# EAGLE schematic Simple-Transmitter-2SC9014 (EAGLE 7.6.0)
Simple FM Transmitter with Electret Microphone, based on NPN Transistor
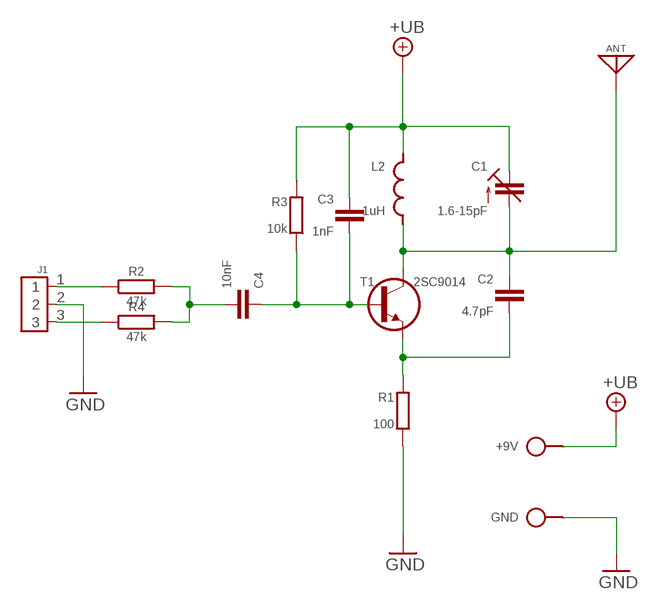
[diagram p0: schematic, sheet 1]

## Parts
+9V  SPAD  [SPAD]
ANT  ANT  [SPAD]
C1  1.6-15pF  C-TR-PH201272222-808-2PINB  [TRIM-2222-808]
C2  4.7pF  C025-015X024  [C025-015X024]
C3  1nF  C025-015X024  [C025-015X024]
C4  10nF  C050-020X036/V  [C050-020X036/V]
GND  SPAD  [SPAD]
J1  CONN-3P-3P  [CONN-3P]
L2  1uH  L-SHORT04/7  [L-04/7]
R1  100  R0204/2V  [0204/2V]
R2  47k  R-H0204/10-V  [0204/10-V]
R3  10k  R0204/10-V  [0204/10-V]
R4  47k  R-H0204/10-V  [0204/10-V]
T1  2SC9014  [TO92-EBC]

## Nets
+UB: +9V.1 C1.3(E) C3.1 L2.2 R3.1
GND: GND.1 J1.2 R1.1
N$1: J1.3 R4.1
N$2: ANT.1 C1.2(A) C2.1 L2.1 T1.C
N$3: C2.2 R1.2 T1.E
N$4: J1.1 R2.1
N$5: C3.2 C4.1 R3.2 T1.B
N$6: C4.2 R2.2 R4.2

## Library data of the parts
+9V GND = pad:SPAD
ANT = pad:ANT
C1 = cap-trim:C-TR-PH20127
C2-C4 = c:C: CAPACITOR, European symbol
J1 = pinconn:CONN-3P
L2 = l:L-SHORT
R1 R3 = r:R: RESISTOR, European symbol
R2 R4 = r:R-H
T1 = t:2SC9014

## Net classes
0 default: width 0.61 mm